# EasyEDA schematic Schematic.json
TITLE: Sheet_1; REV: 1.0; Date: 2025-10-12; Sheet: 1/1; Drawn By: joeljonah06; Company: Your Company
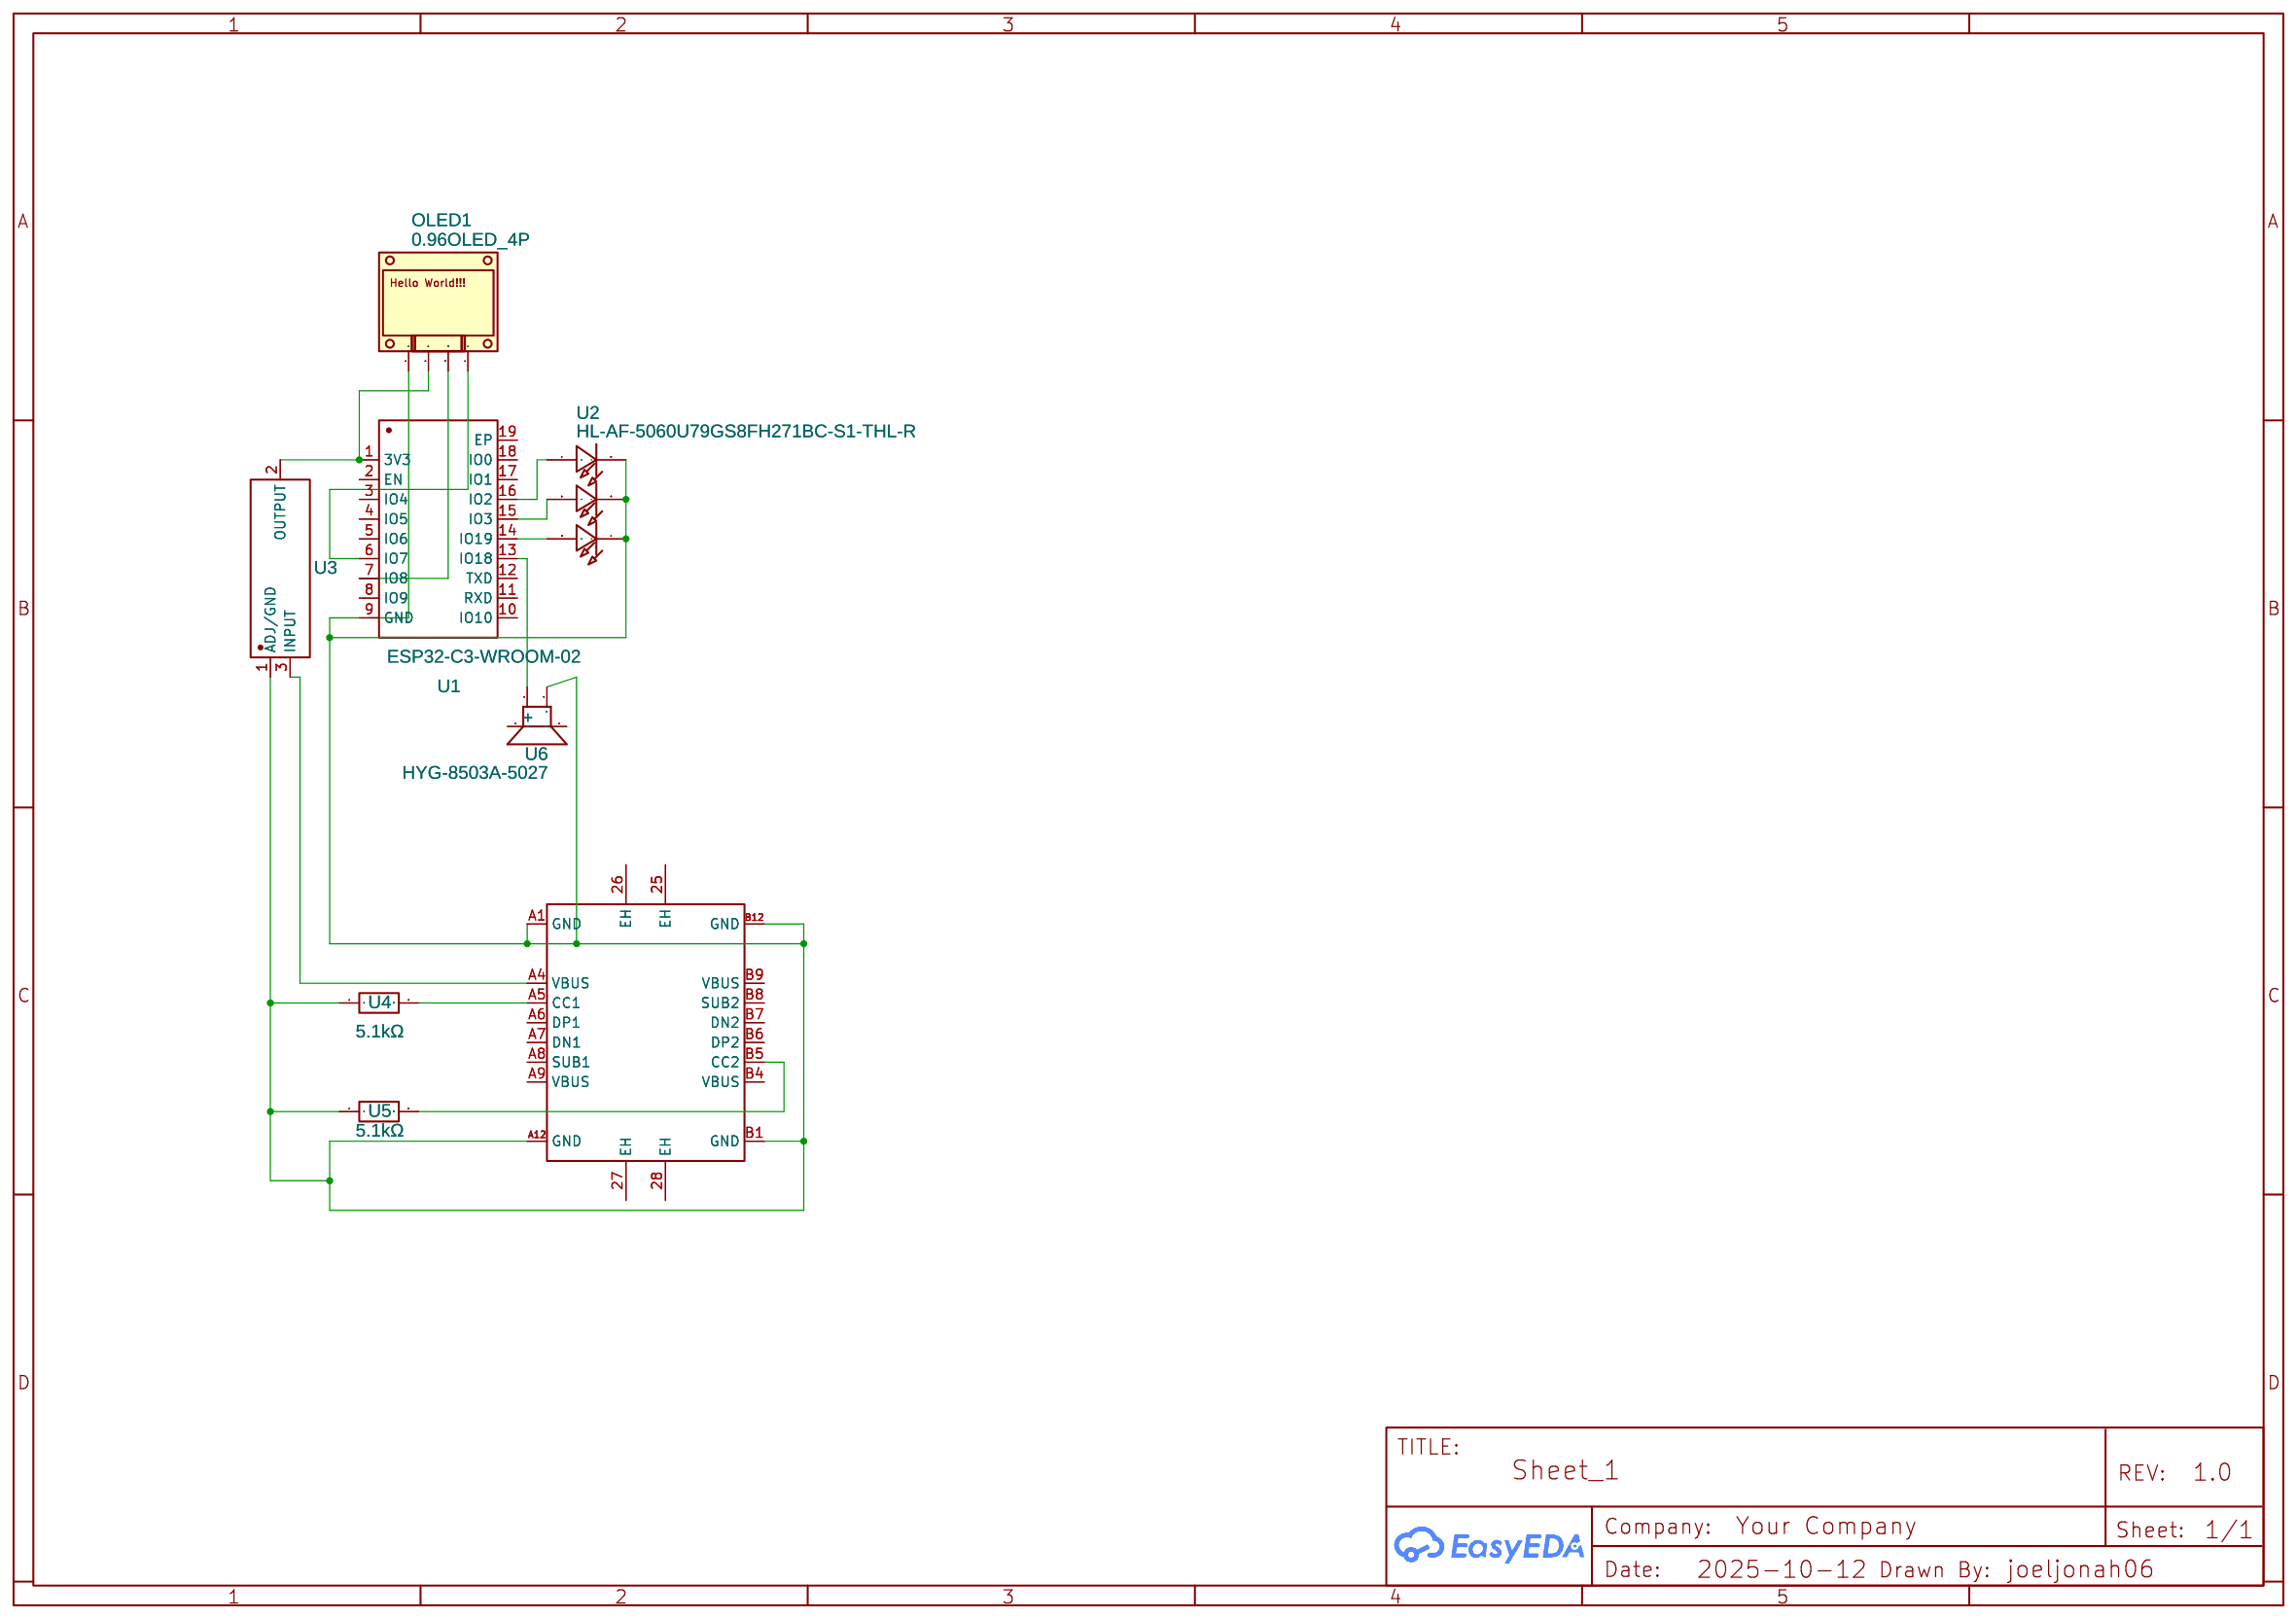
[diagram p0: schematic sheet]

## Parts
OLED1  0.96OLED_4P  [0.96OLED_4P]
U1  ESP32-C3-WROOM-02  [BULETM-SMD_ESPRESSIF_ESP32-C3-WROOM-02-N4-4MB]
U2  HL-AF-5060U79GS8FH271BC-S1-THL-R  [LED-ARRAY-SMD_6P-L5.0-W5.0-P1.60-LS5.3-TR]
U3  AMS1117-3.3_C41414107  [TO-252-2_L6.6-W5.6-P2.3-LS9.7]
U4  5.1kΩ  [R0805]
U5  5.1kΩ  [R0805]
U6  HYG-8503A-5027  [BUZ-SMD_4P-L8.5-W8.5-P8.50-TL-A]
USB1  TYPE-C 16P CB1.6 073  [USB-C-SMD_SHOU_TYPE-C-16P-CB1.6]

## Library data of the parts
OLED1 = 0.96OLED_4P: Supplier: LCSC; Contributor: LCEDA_Lib
U1 = ESP32-C3-WROOM-02-N4(4MB): Contributor: LCSC; Supplier: LCSC; Supplier Part: C2934560; Manufacturer: ESPRESSIF(乐鑫); Manufacturer Part: ESP32-C3-WROOM-02-N4; JLCPCB Part Class: Extended Part
U2 = HL-AF-5060U79GS8FH271BC-S1-THL-R: Supplier: LCSC; Supplier Part: C2999145; Manufacturer: HONGLITRONIC(鸿利光电); JLCPCB Part Class: Extended Part; Contributor: lcsc
U3 = AMS1117-3.3_C41414107: Supplier: LCSC; Supplier Part: C41414107; Manufacturer: YONGYUTAI(永裕泰); Manufacturer Part: AMS1117-3.3; JLCPCB Part Class: Extended Part; Contributor: lcsc
U4 U5 = FRC0805J512TS: Supplier: LCSC; Supplier Part: C2930296; Manufacturer: FOJAN(富捷); JLCPCB Part Class: Extended Part; Contributor: lcsc
U6 = HYG-8503A-5027: Supplier: LCSC; Supplier Part: C18623826; Manufacturer: HYDZ(华宇); Contributor: lcsc; JLCPCB Part Class: Extended Part
USB1 = TYPE-C 16P CB1.6 073: Contributor: LCSC; Supplier: LCSC; Supplier Part: C2906290; Manufacturer: SHOU HAN(首韩); JLCPCB Part Class: Extended Part

## Nets
Net-(OLED1-2): OLED1.2 U1.1(3V3) U3.2(OUTPUT)
Net-(OLED1-3): OLED1.3 U1.7(IO8)
Net-(OLED1-4): OLED1.4 U1.6(IO7)
Net-(U1-9): U1.9(GND) U2.1(-) U2.2(-) U2.3(-) U3.1(ADJ/GND) U4.1 U5.1 U6.2 USB1.A1(GND) USB1.A12(GND) USB1.B1(GND) USB1.B12(GND)
Net-(U1-13): U1.13(IO18) U6.1(+)
Net-(U1-14): U1.14(IO19) U2.6(+)
Net-(U1-15): U1.15(IO3) U2.5(+)
Net-(U1-16): U1.16(IO2) U2.4(+)
Net-(U3-3): U3.3(INPUT) USB1.A4(VBUS)
Net-(U4-2): U4.2 USB1.A5(CC1)
Net-(U5-2): U5.2 USB1.B5(CC2)

Not connected (* = marked no-connect by the designer): OLED1 1; U1 2(EN) 3(IO4) 4(IO5) 5(IO6) 8(IO9) 10(IO10) 11(RXD) 12(TXD) 17(IO1) 18(IO0) 19(EP); U6 3 4; USB1 25(EH) 26(EH) 27(EH) 28(EH) A6(DP1) A7(DN1) A8(SUB1) A9(VBUS) B4(VBUS) B6(DP2) B7(DN2) B8(SUB2) B9(VBUS)
